# Altium project AD6645.PrjPcb
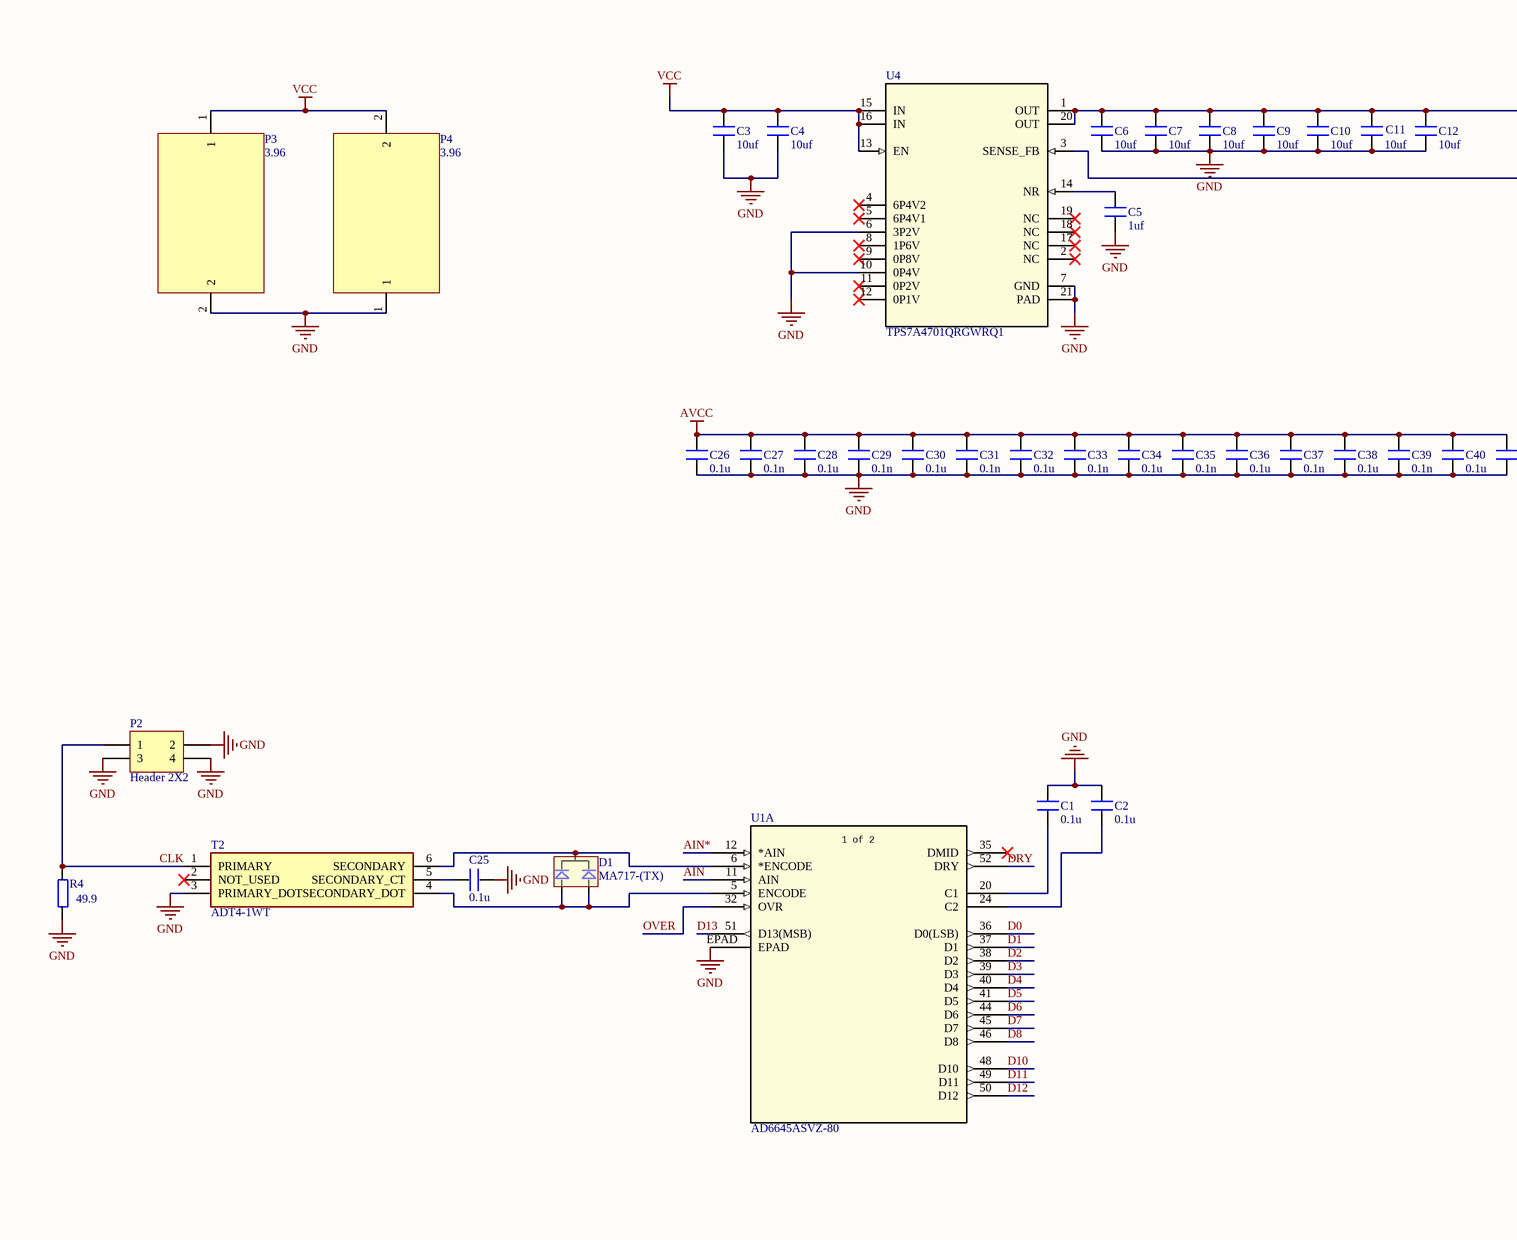
[diagram p0: AD6645.SchDoc, left]
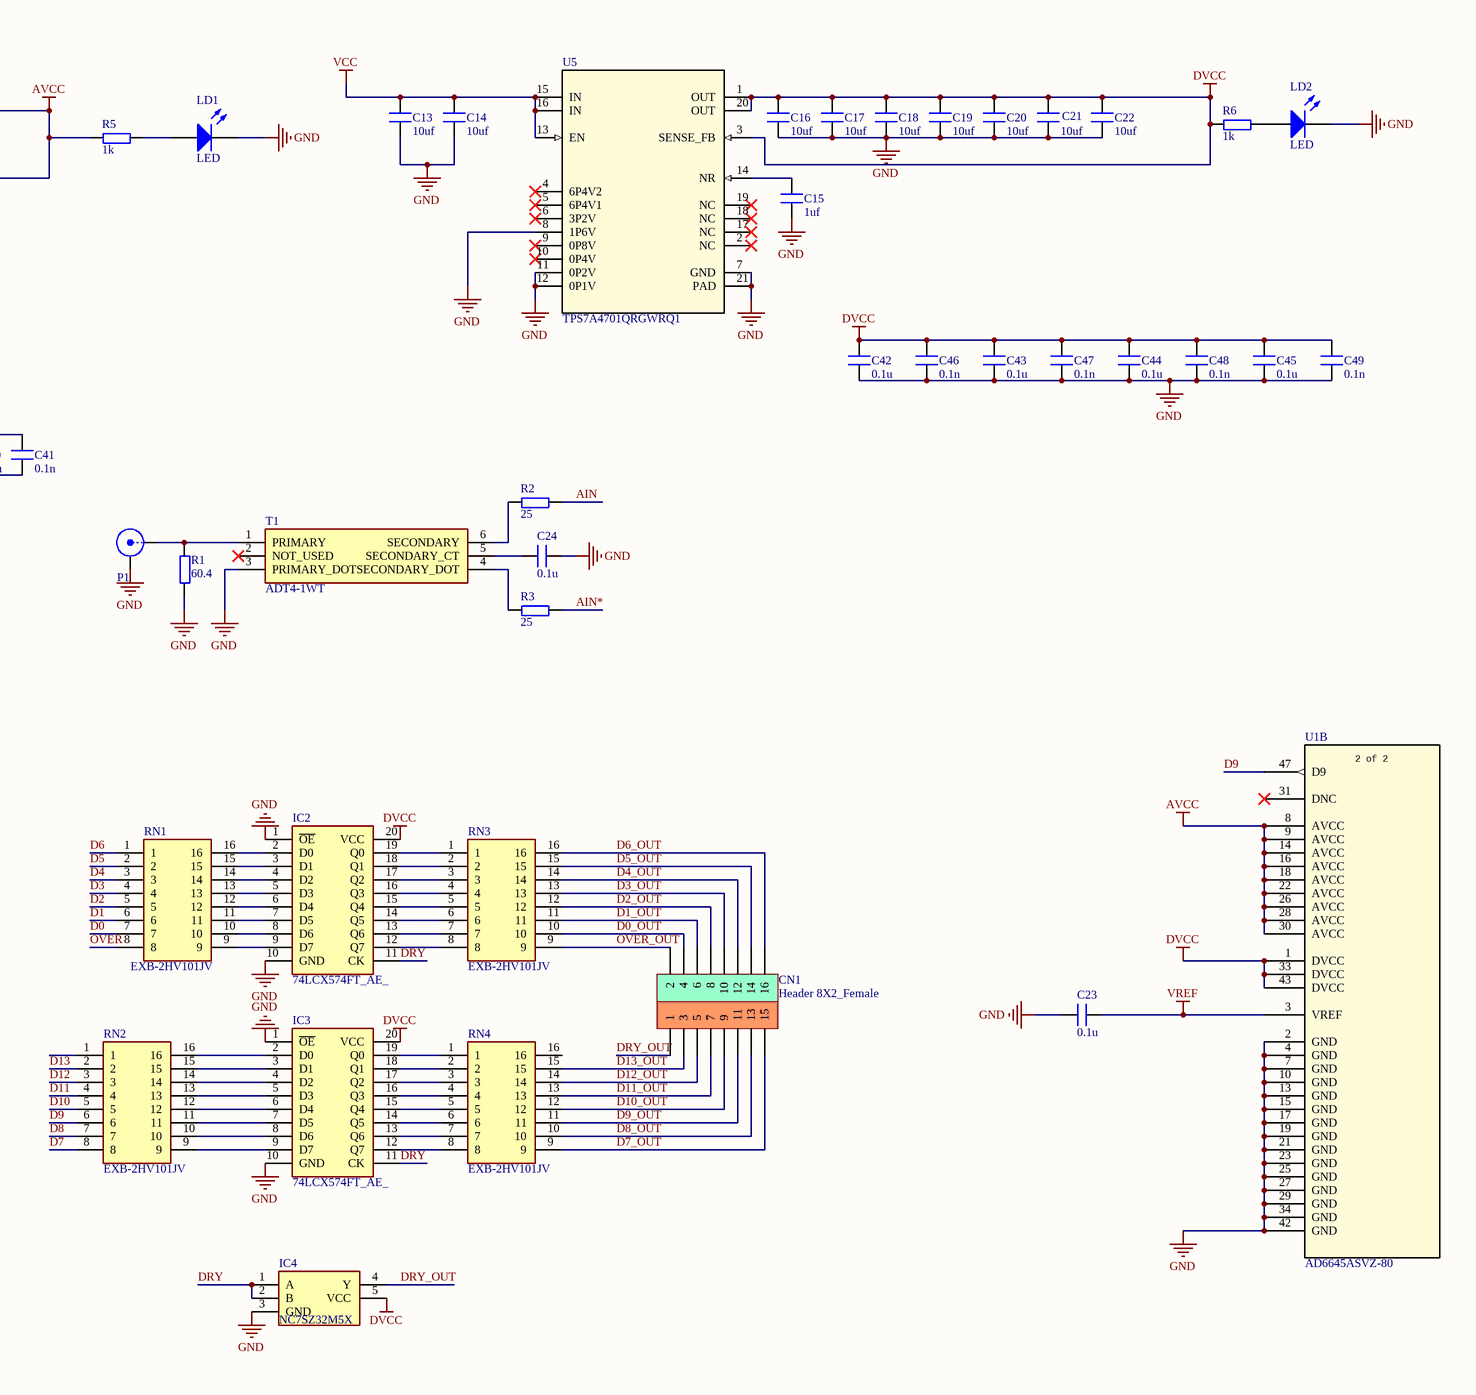
[diagram p1: AD6645.SchDoc, right]
1 sheet, 75 parts. Net scope: global (net labels, ports and power ports of the same name join across sheets).
Board file: AD6645.PcbDoc

## Sheet AD6645.SchDoc
size A2

### Parts
C1  0.1u  [0402]
C2  0.1u  [0402]
C3  10uf  [0603C]
C4  10uf  [0603C]
C5  1uf  [0402]
C6  10uf  [0603C]
C7  10uf  [0603C]
C8  10uf  [0603C]
C9  10uf  [0603C]
C10  10uf  [0603C]
C11  10uf  [0603C]
C12  10uf  [0603C]
C13  10uf  [0603C]
C14  10uf  [0603C]
C15  1uf  [0402]
C16  10uf  [0603C]
C17  10uf  [0603C]
C18  10uf  [0603C]
C19  10uf  [0603C]
C20  10uf  [0603C]
C21  10uf  [0603C]
C22  10uf  [0603C]
C23  0.1u  [0402]
C24  0.1u  [0603C]
C25  0.1u  [0603C]
C26  0.1u  [0402]
C27  0.1n  [0402]
C28  0.1u  [0402]
C29  0.1n  [0402]
C30  0.1u  [0402]
C31  0.1n  [0402]
C32  0.1u  [0402]
C33  0.1n  [0402]
C34  0.1u  [0402]
C35  0.1n  [0402]
C36  0.1u  [0402]
C37  0.1n  [0402]
C38  0.1u  [0402]
C39  0.1n  [0402]
C40  0.1u  [0402]
C41  0.1n  [0402]
C42  0.1u  [0402]
C43  0.1u  [0402]
C44  0.1u  [0402]
C45  0.1u  [0402]
C46  0.1n  [0402]
C47  0.1n  [0402]
C48  0.1n  [0402]
C49  0.1n  [0402]
CN1  Header 8X2_Female  [HDR_8x2_2R54_V_F]
D1  MA717-(TX)  [SOT-23]
IC2  74LCX574FT_AE_  [SOP65P640X120-20N]
IC3  74LCX574FT_AE_  [SOP65P640X120-20N]
IC4  NC7SZ32M5X  [SOT95P280X145-5N]
LD1  LED  [SMDLED]
LD2  LED  [SMDLED]
P1  SMA  [SMA]  (value not drawn)
P2  Header 2X2  [HDR2X2]
P3  3.96  [3.96]
P4  3.96  [3.96]
R1  60.4  [0603R]
R2  25  [0603R]
R3  25  [0603R]
R4  49.9  [0603R]
R5  1k  [0603R]
R6  1k  [0603R]
RN1  EXB-2HV101JV  [EXB2HV101JV]
RN2  EXB-2HV101JV  [EXB2HV101JV]
RN3  EXB-2HV101JV  [EXB2HV101JV]
RN4  EXB-2HV101JV  [EXB2HV101JV]
T1  ADT4-1WT  [ADT41WT]
T2  ADT4-1WT  [ADT41WT]
U1  AD6645ASVZ-80  [SV_52_1_ADI]  (parts A,B of 2)
U4  TPS7A4701QRGWRQ1  [RGW0020A]
U5  TPS7A4701QRGWRQ1  [RGW0020A]

### Nets
AVCC: C6.2 C7.2 C8.2 C9.2 C10.2 C11.2 C12.2 C26.2 C27.2 C28.2 C29.2 C30.2 C31.2 C32.2 C33.2 C34.2 C35.2 C36.2 C37.2 C38.2 C39.2 C40.2 C41.2 R5.1 U1.8(AVCC) U1.9(AVCC) U1.14(AVCC) U1.16(AVCC) U1.18(AVCC) U1.22(AVCC) U1.26(AVCC) U1.28(AVCC) U1.30(AVCC) U4.1(OUT) U4.3(SENSE_FB) U4.20(OUT)
DVCC: C16.2 C17.2 C18.2 C19.2 C20.2 C21.2 C22.2 C42.2 C43.2 C44.2 C45.2 C46.2 C47.2 C48.2 C49.2 IC2.20(VCC) IC3.20(VCC) IC4.5(VCC) R6.1 U1.1(DVCC) U1.33(DVCC) U1.43(DVCC) U5.1(OUT) U5.3(SENSE_FB) U5.20(OUT)
GND: C1.2 C2.2 C3.1 C4.1 C5.1 C6.1 C7.1 C8.1 C9.1 C10.1 C11.1 C12.1 C13.1 C14.1 C15.1 C16.1 C17.1 C18.1 C19.1 C20.1 C21.1 C22.1 C23.1 C24.2 C25.2 C26.1 C27.1 C28.1 C29.1 C30.1 C31.1 C32.1 C33.1 C34.1 C35.1 C36.1 C37.1 C38.1 C39.1 C40.1 C41.1 C42.1 C43.1 C44.1 C45.1 C46.1 C47.1 C48.1 C49.1 IC2.1(~{OE}) IC2.10(GND) IC3.1(~{OE}) IC3.10(GND) IC4.3(GND) LD1.2(K) LD2.2(K) P1.2(Y) P2.2 P2.3 P2.4 P3.2 P4.1 R1.1 R4.1 T1.3(PRIMARY_DOT) T2.3(PRIMARY_DOT) U1.2(GND) U1.4(GND) U1.7(GND) U1.10(GND) U1.13(GND) U1.15(GND) U1.17(GND) U1.19(GND) U1.21(GND) U1.23(GND) U1.25(GND) U1.27(GND) U1.29(GND) U1.34(GND) U1.42(GND) U1.EPAD U4.6(3P2V) U4.7(GND) U4.10(0P4V) U4.21(PAD) U5.7(GND) U5.8(1P6V) U5.11(0P2V) U5.12(0P1V) U5.21(PAD)
VCC: C3.2 C4.2 C13.2 C14.2 P3.1 P4.2 U4.13(EN) U4.15(IN) U4.16(IN) U5.13(EN) U5.15(IN) U5.16(IN)
VREF: C23.2 U1.3(VREF)
AIN: R2.2 U1.11(AIN)
AIN*: R3.2 U1.12(*AIN)
CLK: P2.1 R4.2 T2.1(PRIMARY)
D0: RN1.7 U1.36(D0(LSB))
D0_OUT: CN1.4 RN3.10
D1: RN1.6 U1.37(D1)
D1_OUT: CN1.6 RN3.11
D2: RN1.5 U1.38(D2)
D2_OUT: CN1.8 RN3.12
D3: RN1.4 U1.39(D3)
D3_OUT: CN1.10 RN3.13
D4: RN1.3 U1.40(D4)
D4_OUT: CN1.12 RN3.14
D5: RN1.2 U1.41(D5)
D5_OUT: CN1.14 RN3.15
D6: RN1.1 U1.44(D6)
D6_OUT: CN1.16 RN3.16
D7: RN2.8 U1.45(D7)
D7_OUT: CN1.15 RN4.9
D8: RN2.7 U1.46(D8)
D8_OUT: CN1.13 RN4.10
D9: RN2.6 U1.47(D9)
D9_OUT: CN1.11 RN4.11
D10: RN2.5 U1.48(D10)
D10_OUT: CN1.9 RN4.12
D11: RN2.4 U1.49(D11)
D11_OUT: CN1.7 RN4.13
D12: RN2.3 U1.50(D12)
D12_OUT: CN1.5 RN4.14
D13: RN2.2 U1.51(D13(MSB))
D13_OUT: CN1.3 RN4.15
DRY: IC2.11(CK) IC3.11(CK) IC4.1(A) IC4.2(B) U1.52(DRY)
DRY_OUT: CN1.1 IC4.4(Y)
OVER: RN1.8 U1.32(OVR)
OVER_OUT: CN1.2 RN3.9
NetC1_1: C1.1 U1.20(C1)
NetC2_1: C2.1 U1.24(C2)
NetC5_2: C5.2 U4.14(NR)
NetC15_2: C15.2 U5.14(NR)
NetC24_1: C24.1 T1.5(SECONDARY_CT)
NetC25_1: C25.1 T2.5(SECONDARY_CT)
NetD1_1: D1.1 D1.2 T2.4(SECONDARY_DOT) U1.5(ENCODE)
NetD1_3: D1.3 T2.6(SECONDARY) U1.6(*ENCODE)
NetIC2_2: IC2.2(D0) RN1.16
NetIC2_3: IC2.3(D1) RN1.15
NetIC2_4: IC2.4(D2) RN1.14
NetIC2_5: IC2.5(D3) RN1.13
NetIC2_6: IC2.6(D4) RN1.12
NetIC2_7: IC2.7(D5) RN1.11
NetIC2_8: IC2.8(D6) RN1.10
NetIC2_9: IC2.9(D7) RN1.9
NetIC2_12: IC2.12(Q7) RN3.8
NetIC2_13: IC2.13(Q6) RN3.7
NetIC2_14: IC2.14(Q5) RN3.6
NetIC2_15: IC2.15(Q4) RN3.5
NetIC2_16: IC2.16(Q3) RN3.4
NetIC2_17: IC2.17(Q2) RN3.3
NetIC2_18: IC2.18(Q1) RN3.2
NetIC2_19: IC2.19(Q0) RN3.1
NetIC3_2: IC3.2(D0) RN2.16
NetIC3_3: IC3.3(D1) RN2.15
NetIC3_4: IC3.4(D2) RN2.14
NetIC3_5: IC3.5(D3) RN2.13
NetIC3_6: IC3.6(D4) RN2.12
NetIC3_7: IC3.7(D5) RN2.11
NetIC3_8: IC3.8(D6) RN2.10
NetIC3_9: IC3.9(D7) RN2.9
NetIC3_12: IC3.12(Q7) RN4.8
NetIC3_13: IC3.13(Q6) RN4.7
NetIC3_14: IC3.14(Q5) RN4.6
NetIC3_15: IC3.15(Q4) RN4.5
NetIC3_16: IC3.16(Q3) RN4.4
NetIC3_17: IC3.17(Q2) RN4.3
NetIC3_18: IC3.18(Q1) RN4.2
NetIC3_19: IC3.19(Q0) RN4.1
NetLD1_1: LD1.1(A) R5.2
NetLD2_1: LD2.1(A) R6.2
NetP1_1: P1.1(X) R1.2 T1.1(PRIMARY)
NetR2_1: R2.1 T1.6(SECONDARY)
NetR3_1: R3.1 T1.4(SECONDARY_DOT)

Not connected (* = marked no-connect by the designer): RN2 1; RN4 16; T1 2(NOT_USED)*; T2 2(NOT_USED)*; U1 31(DNC)* 35(DMID)*; U4 2(NC)* 4(6P4V2)* 5(6P4V1)* 8(1P6V)* 9(0P8V)* 11(0P2V)* 12(0P1V)* 17(NC)* 18(NC)* 19(NC)*; U5 2(NC)* 4(6P4V2)* 5(6P4V1)* 6(3P2V)* 9(0P8V)* 10(0P4V)* 17(NC)* 18(NC)* 19(NC)*

### Notes on the sheet
- (in symbol AD6645ASVZ-80, part A) 1 of 2
- (in symbol AD6645ASVZ-80, part B) 2 of 2

### Library data of the parts
C1-C49 = C: Capacitor
CN1 = Header 8X2_Female: Header, 8-Pin, Dual row,female; LatestRevisionDate: 17-Jul-2002; LatestRevisionNote: Re-released for DXP Platform.; Publisher: Altium Limited
D1 = BAT54C: 双肖特基二极管
IC2 IC3 = 74LCX574FT_AE_: Integrated Circuit; Manufacturer_Name: Toshiba; Manufacturer_Part_Number: 74LCX574FT(AE); Datasheet Link: https://www.mouser.com.gt/datasheet/2/408/74LCX574FT_datasheet_en_20140624-771474.pdf; Height: 1.2mm
IC4 = NC7SZ32M5X: Integrated Circuit; Manufacturer_Name: ON Semiconductor; Datasheet Link: http://docs-emea.rs-online.com/webdocs/0f9b/0900766b80f9b555.pdf; Height: 1.45mm; Manufacturer_Part_Number: NC7SZ32M5X; Mouser Part Number: 512-NC7SZ32M5X; Mouser Price/Stock: https://www.mouser.co.uk/ProductDetail/ON-Semiconductor-Fairchild/NC7SZ32M5X?qs=FF3lEoAMV0utdIYQyXzmdA%3D%3D; Arrow Part Number: NC7SZ32M5X; Arrow Price/Stock: https://www.arrow.com/en/products/nc7sz32m5x/on-semiconductor
LD1 LD2 = LED: Typical RED, GREEN, YELLOW, AMBER GaAs LED; Published: 8-Jun-2000; LatestRevisionDate: 17-Jul-2002; LatestRevisionNote: Re-released for DXP Platform.; PackageDocument: Feb-2002; PackageReference: 3.2X1.6X1.1; Publisher: Altium Limited
P1 = SMA: SMA Connector
P2 = Header 2X2: Header, 2-Pin, Dual row; LatestRevisionDate: 17-Jul-2002; LatestRevisionNote: Re-released for DXP Platform.; Publisher: Altium Limited
R1-R6 = Resistor
RN1-RN4 = EXB-2HV101JV: Resistor Network; Manufacturer_Name: Panasonic; Datasheet Link: https://industrial.panasonic.com/cdbs/www-data/pdf/AOC0000/AOC0000C14.pdf; Height: 0.55mm; Manufacturer_Part_Number: EXB-2HV101JV; Mouser Part Number: 667-EXB-2HV101JV; Mouser Price/Stock: https://www.mouser.co.uk/ProductDetail/Panasonic/EXB-2HV101JV?qs=oE3VwAv%2FYtkI4Sp%252Bk267NQ%3D%3D; Arrow Part Number: EXB-2HV101JV; Arrow Price/Stock: https://www.arrow.com/en/products/exb-2hv101jv/panasonic
T1 T2 = ADT4-1WT: Transformer; Manufacturer_Name: Mini-Circuits; Datasheet Link: https://ww3.minicircuits.com/pdfs/ADT4-1WT.pdf; Height: 2.84mm; Manufacturer_Part_Number: ADT4-1WT
U1 = AD6645ASVZ-80: No Description Available; SourceLibrary: Analog_2015-01-06; Built_By: EMA_UL_Team; Vendor: Analog Devices Inc; Manufacturer_Part_Number: AD6645ASVZ-80; Copyright: Copyright (C) 2021 Accelerated Designs. All rights reserved; RefDes: RefDes; Type: DEV
U4 U5 = TPS7A4701QRGWRQ1: No Description Available; Manufacturer: Texas Instruments; PartNumber: TPS7A4701QRGWRQ1; RefDes: RefDes; Type: DEV; Value: Value; Copyright: Copyright (C) 2018 Accelerated Designs. All rights reserved